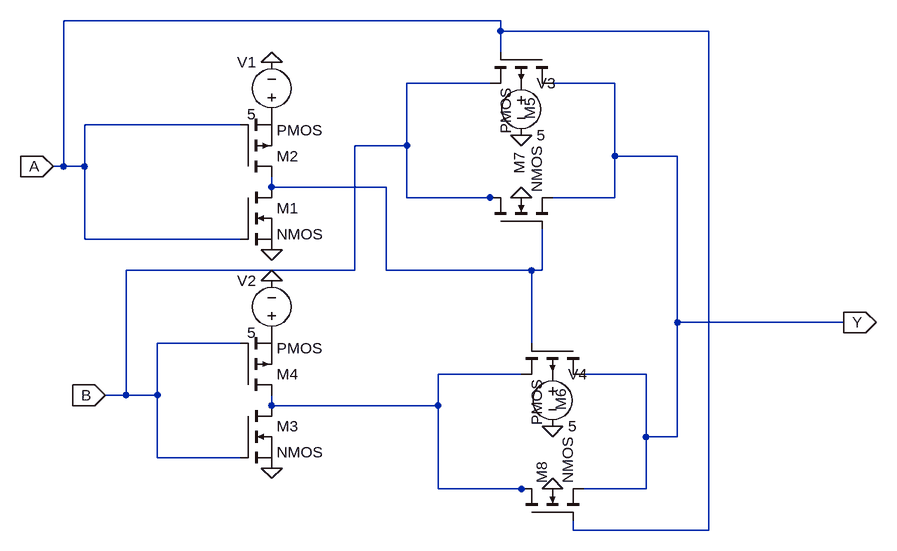
[diagram p0: schematic XOR2.asc]
XOR2.asc, the LTspice schematic file:
Version 4
SHEET 1 988 680
WIRE 384 -224 -288 -224
WIRE 384 -208 384 -224
WIRE 704 -208 384 -208
WIRE 384 -176 384 -208
WIRE 368 -128 240 -128
WIRE 560 -128 464 -128
WIRE -16 -64 -256 -64
WIRE 240 -32 240 -128
WIRE 240 -32 160 -32
WIRE 560 -16 560 -128
WIRE 656 -16 560 -16
WIRE -288 0 -288 -224
WIRE -288 0 -304 0
WIRE -256 0 -256 -64
WIRE -256 0 -288 0
WIRE 32 32 32 16
WIRE 208 32 32 32
WIRE 240 48 240 -32
WIRE 368 48 240 48
WIRE 384 48 368 48
WIRE 560 48 560 -16
WIRE 560 48 464 48
WIRE -256 112 -256 0
WIRE -16 112 -256 112
WIRE 160 160 160 -32
WIRE 160 160 -192 160
WIRE 208 160 208 32
WIRE 432 160 208 160
WIRE 448 160 448 96
WIRE 448 160 432 160
WIRE 656 240 656 -16
WIRE 912 240 656 240
WIRE -16 272 -144 272
WIRE 432 272 432 160
WIRE 416 320 288 320
WIRE 608 320 512 320
WIRE -192 352 -192 160
WIRE -192 352 -224 352
WIRE -144 352 -144 272
WIRE -144 352 -192 352
WIRE 32 368 32 352
WIRE 288 368 288 320
WIRE 288 368 32 368
WIRE 608 416 608 320
WIRE 656 416 656 240
WIRE 656 416 608 416
WIRE -144 448 -144 352
WIRE -16 448 -144 448
WIRE 288 496 288 368
WIRE 416 496 288 496
WIRE 432 496 416 496
WIRE 608 496 608 416
WIRE 608 496 512 496
WIRE 496 560 496 544
WIRE 704 560 704 -208
WIRE 704 560 496 560
FLAG -304 0 A
IOPIN -304 0 In
FLAG 32 128 0
FLAG 32 -160 0
FLAG -224 352 B
IOPIN -224 352 In
FLAG 32 464 0
FLAG 32 176 0
FLAG 416 -48 0
FLAG 464 400 0
FLAG 416 48 0
FLAG 464 496 0
FLAG 912 240 Y
IOPIN 912 240 Out
SYMBOL nmos -16 32 R0
SYMATTR InstName M1
SYMBOL pmos -16 16 M180
SYMATTR InstName M2
SYMBOL voltage 32 -64 R180
WINDOW 0 24 96 Left 2
WINDOW 3 24 16 Left 2
SYMATTR InstName V1
SYMATTR Value 5
SYMBOL nmos -16 368 R0
SYMATTR InstName M3
SYMBOL pmos -16 352 M180
SYMATTR InstName M4
SYMBOL voltage 32 272 R180
WINDOW 0 24 96 Left 2
WINDOW 3 24 16 Left 2
SYMATTR InstName V2
SYMATTR Value 5
SYMBOL pmos4 464 -176 R90
WINDOW 0 70 35 Left 2
SYMATTR InstName M5
SYMBOL voltage 416 -144 R0
SYMATTR InstName V3
SYMATTR Value 5
SYMBOL pmos4 512 272 R90
WINDOW 0 70 35 Left 2
SYMATTR InstName M6
SYMBOL voltage 464 304 R0
SYMATTR InstName V4
SYMATTR Value 5
SYMBOL nmos4 368 96 R270
WINDOW 0 84 45 Left 2
SYMATTR InstName M7
SYMBOL nmos4 416 544 R270
SYMATTR InstName M8

The netlist it stands for:
* XOR2.asc
M1 N001 A 0 0 NMOS
M2 N001 A P001 P001 PMOS
V1 P001 0 5
M3 N002 B 0 0 NMOS
M4 N002 B P002 P002 PMOS
V2 P002 0 5
M5 Y A B P003 PMOS
V3 P003 0 5
M6 Y N001 N002 P004 PMOS
V4 P004 0 5
M7 B N001 Y 0 NMOS
M8 N002 A Y 0 NMOS
.model NMOS NMOS
.model PMOS PMOS
.lib standard.mos
.backanno
.end